# Altium project SAU-G0.PrjPcb
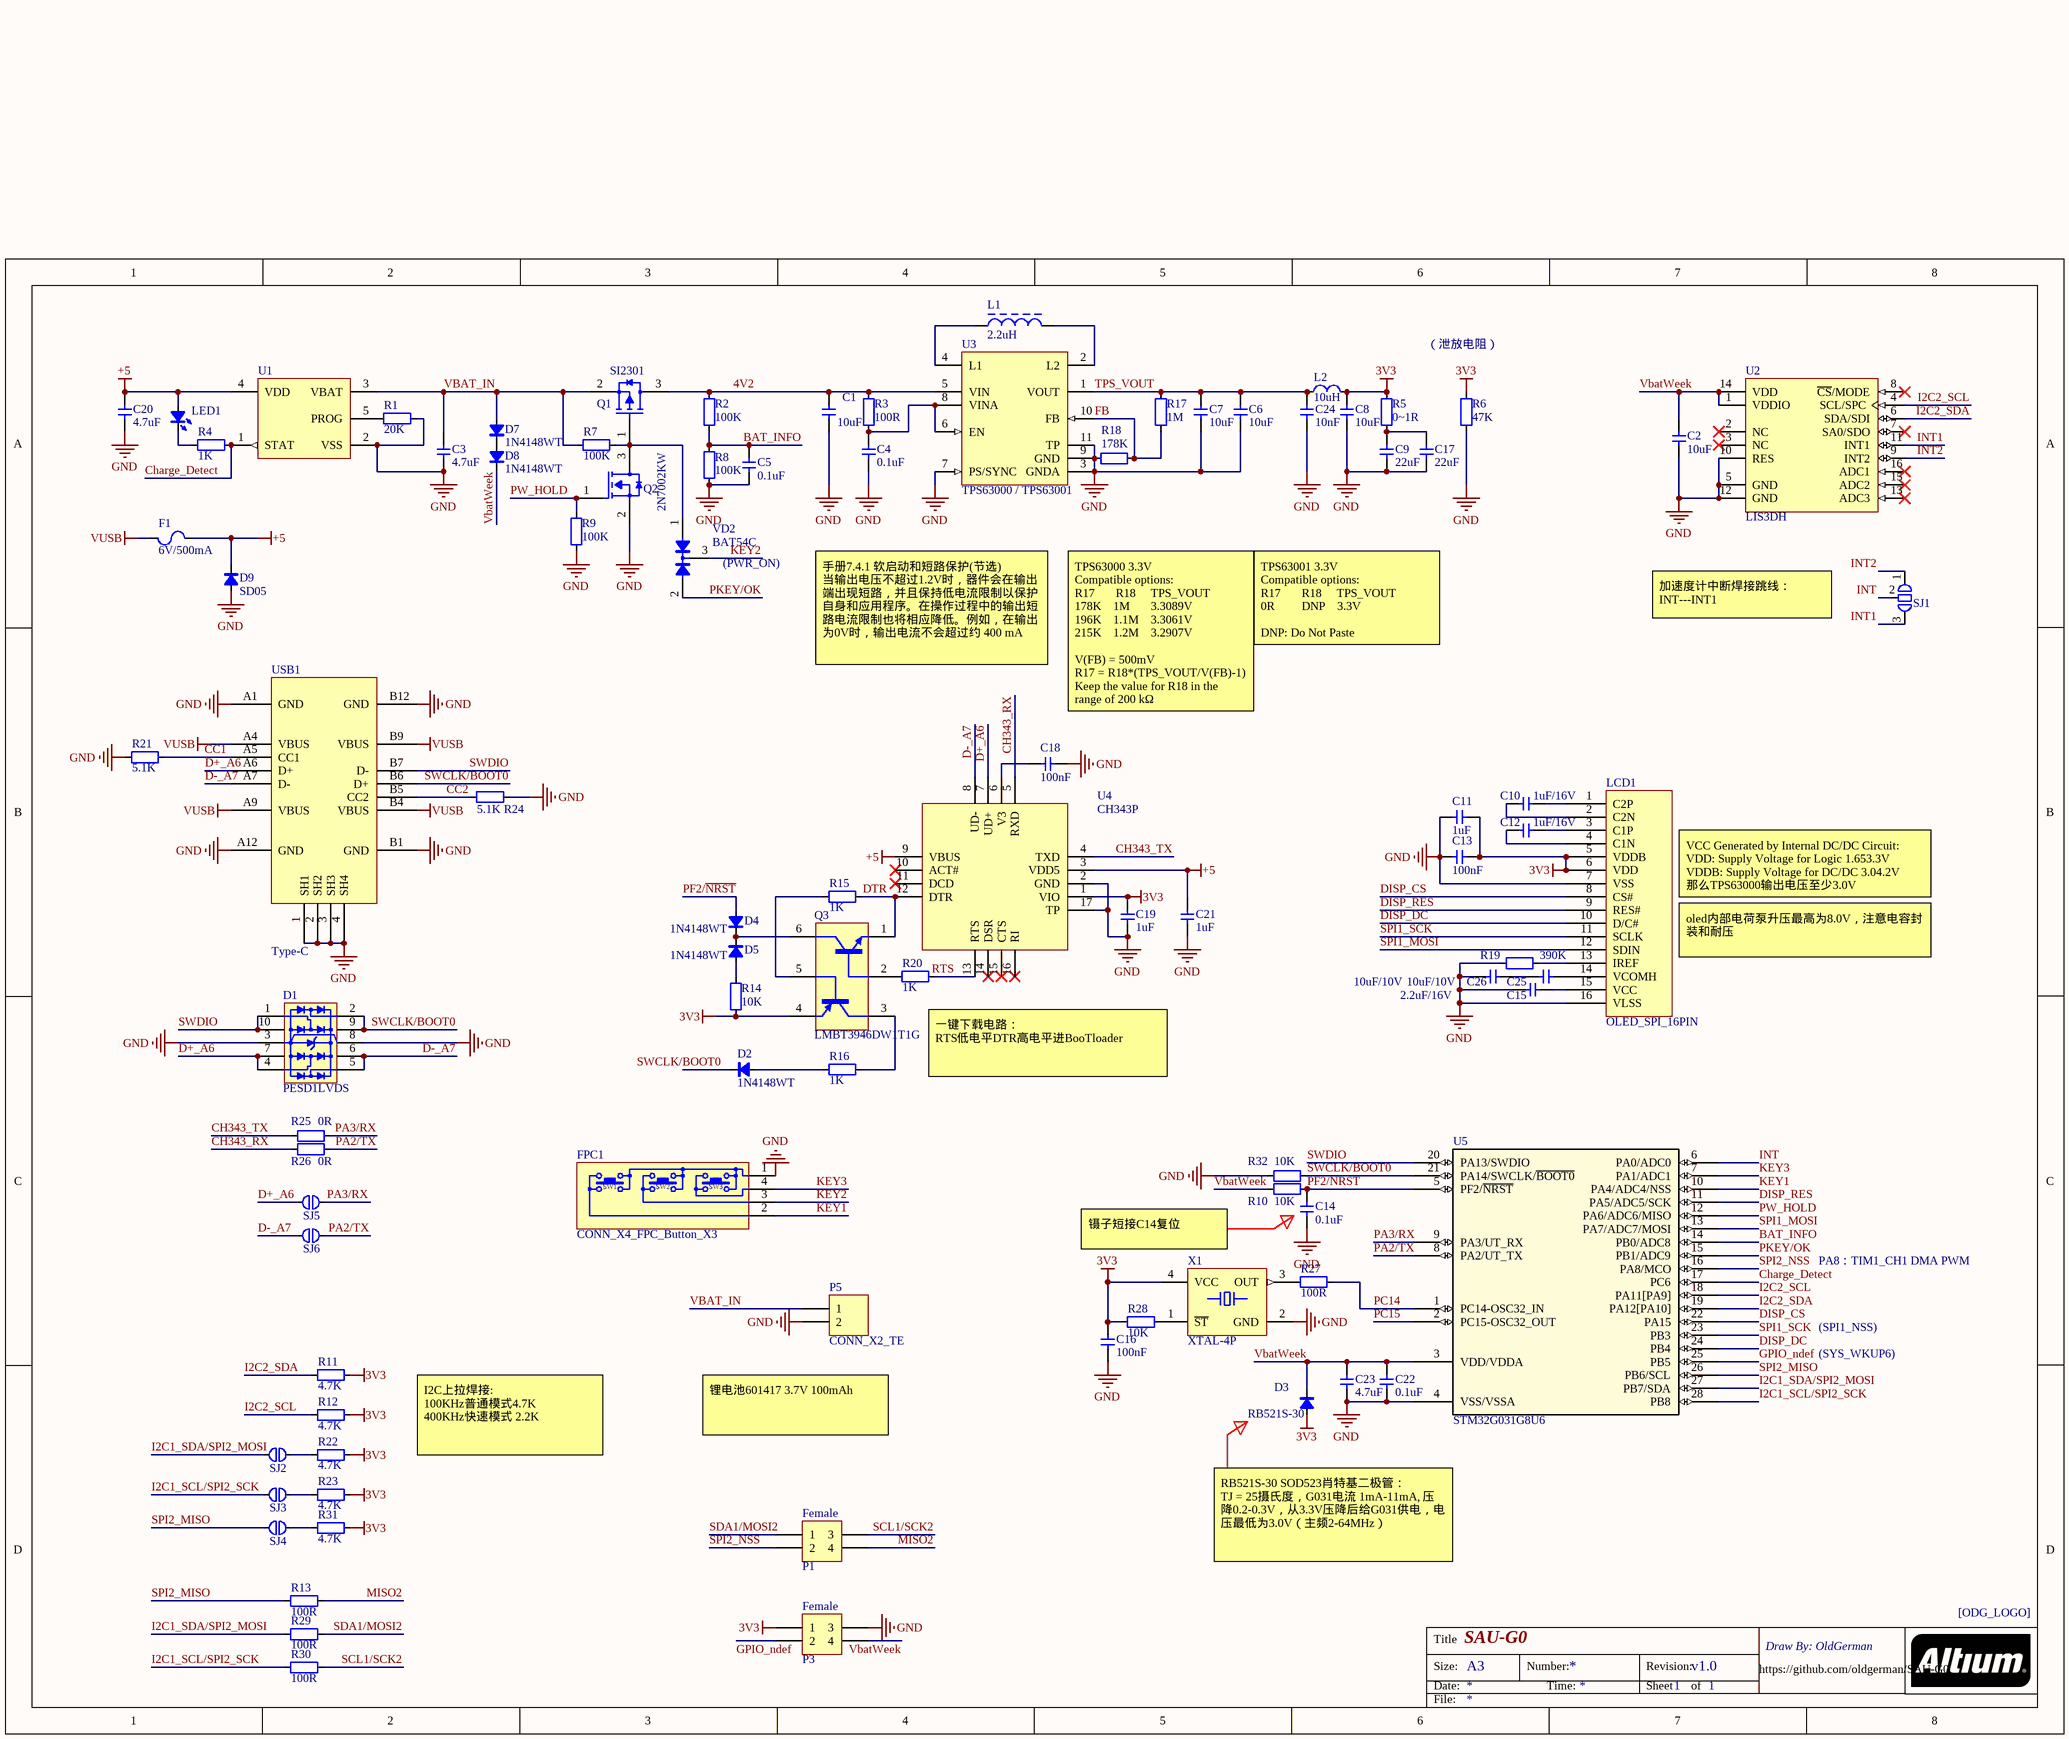
[diagram p0: SAU-G0_sheet1.SchDoc]
1 sheet, 93 parts. Net scope: global (net labels, ports and power ports of the same name join across sheets).
Board file: SAU-G0.PcbDoc

## Sheet SAU-G0_sheet1.SchDoc: SAU-G0
size A3; Address1: Draw By: OldGerman; Revision: v1.0; SheetNumber: 1; SheetTotal: 1

### Parts
C1  10uF  [C0402]
C2  10uF  [C0402]
C3  4.7uF  [C0603]
C4  0.1uF  [C0402]
C5  0.1uF  [C0402]
C6  10uF  [C0402]
C7  10uF  [C0402]
C8  10uF  [C0402]
C9  22uF  [C0603]
C10  1uF/16V  [C0402]
C11  1uF  [C0402]
C12  1uF/16V  [C0402]
C13  100nF  [C0402]
C14  0.1uF  [C0402]
C15  2.2uF/16V  [C0603]
C16  100nF  [C0402]
C17  22uF  [C0603]
C18  100nF  [C0402]
C19  1uF  [C0402]
C20  4.7uF  [C0603]
C21  1uF  [C0402]
C22  0.1uF  [C0402]
C23  4.7uF  [C0402]
C24  10nF  [C0402]
C25  10uF/10V  [C0402]
C26  10uF/10V  [C0402]
D1  PESD1LVDS  [DFN2510-10_SOT1165-1]
D2  1N4148WT  [SOD-523]
D3  RB521S-30  [SOD-523]
D4  1N4148WT  [SOD-523]
D5  1N4148WT  [SOD-523]
D7  1N4148WT  [SOD-523]
D8  1N4148WT  [SOD-523]
D9  SD05  [SOD-323]
F1  6V/500mA  [FUSE0603_0.5MM]
FPC1  CONN_X4_FPC_Button_X3  [FPC_Buttons_X3_Flip_to_PCB_Buttom_to_Back_3.06mm_NO_3D_NO_SLIK_1]
L1  2.2uH  [TAIYO YUDEN MAMK2520T1R0M]
L2  10uH  [FER0603]
LCD1  OLED_SPI_16PIN  [oled_64x48_0.66_SSD1306_TOP_FPC_to_BACK_1mm_NO_3D_NO_SLIK_1]
LED1  LED  [LED0603_WHITE]  (value not drawn)
ODG4  ODG_LOGO  [ODG_LOGO]  (value not drawn)
P1  Female  [2.0mm_Fmale_2x2]
P3  Female  [2.0mm_Fmale_2x2]
P5  CONN_X2_TE  [TE-198181x_Female+Male]
Q1  SI2301  [INFINEON SOT-23-3]
Q2  2N7002KW  [DIODES SOT-323-3]
Q3  LMBT3946DW1T1G  [ON SEMI SOT-363]
R1  20K  [R0402]
R2  100K  [R0402]
R3  100R  [R0402]
R4  1K  [R0402]
R5  0~1R  [R0402]
R6  47K  [R0603]
R7  100K  [R0402]
R8  100K  [R0402]
R9  100K  [R0402]
R10  10K  [R0402]
R11  4.7K  [R0402]
R12  4.7K  [R0402]
R13  100R  [R0402]
R14  10K  [R0402]
R15  1K  [R0402]
R16  1K  [R0402]
R17  1M  [R0402]
R18  178K  [R0402]
R19  390K  [R0402]
R20  1K  [R0402]
R21  5.1K  [R0402]
R22  4.7K  [R0402]
R23  4.7K  [R0402]
R24  5.1K  [R0402]
R25  0R  [R0402]
R26  0R  [R0402]
R27  100R  [R0402]
R28  10K  [R0402]
R29  100R  [R0402]
R30  100R  [R0402]
R31  4.7K  [R0402]
R32  10K  [R0402]
SJ1  SJ_3P  [SJ_3P_MINI]  (value not drawn)
SJ2  SJ_2P  [SJ_2P_TINY]  (value not drawn)
SJ3  SJ_2P  [SJ_2P_TINY]  (value not drawn)
SJ4  SJ_2P  [SJ_2P_TINY]  (value not drawn)
SJ5  SJ_2P  [SJ_2P_TINY]  (value not drawn)
SJ6  SJ_2P  [SJ_2P_TINY]  (value not drawn)
U1  MCP73831T  [MICROCHIP SOT-23-5 OT]  (value not drawn)
U2  LIS3DH  [LGA-16-3X3]
U3  TPS63000 / TPS63001  [TI PVSON-10 3x3MM DRC]
U4  CH343P  [CH343P_QFN-16 3x3MM]
U5  STM32G031G8U6  [UFQFPN28-4x4mm_ODG]
USB1  Type-C  [TYPE-C_14P_Vertical_H_10mm]
VD2  BAT54C  [DIODES SOT-323-3]
X1  XTAL-4P  [NDK NX2520SA]

### Nets
3V3: C8.1 C11.1 C13.2 C16.1 C19.2 D3.1(A) L2.2 LCD1.5(VDDB) LCD1.6(VDD) P3.1 Q3.4(E) R5.2 R6.2 R11.1 R12.1 R14.1 R22.1 R23.1 R28.2 R31.1 U4.1(VIO) X1.4(VCC)
+5: C20.1 C21.2 D9.2(C) F1.2 LED1.1(A) U1.4(VDD) U4.3(VDD5) U4.9(VBUS)
GND: C1.2 C2.2 C3.2 C4.2 C5.2 C6.2 C7.2 C8.2 C9.2 C11.2 C13.1 C14.2 C15.2 C16.2 C17.2 C18.2 C19.1 C20.2 C21.1 C22.2 C23.2 C24.2 C26.2 D1.3(GND) D1.8(GND) D9.1(A) FPC1.1 LCD1.7(VSS) LCD1.16(VLSS) P3.3 P5.2 Q2.2(S) R1.1 R6.1 R8.1 R9.1 R18.2 R19.1 R21.2 R24.1 R32.1 U1.2(VSS) U2.5(GND) U2.10(RES) U2.12(GND) U3.3(GNDA) U3.7(PS/SYNC) U3.9(GND) U3.11(TP) U4.2(GND) U4.17(TP) U5.4(VSS/VSSA) USB1.1(SH1) USB1.2(SH2) USB1.3(SH3) USB1.4(SH4) USB1.A1(GND) USB1.A12(GND) USB1.B1(GND) USB1.B12(GND) X1.2(GND)
VUSB: F1.1 USB1.A4(VBUS) USB1.A9(VBUS) USB1.B4(VBUS) USB1.B9(VBUS)
4V2: C1.1 Q1.3(D) R2.2 R3.2 U3.5(VIN)
BAT_INFO: C5.1 R2.1 R8.2 U5.14(PB0/ADC8)
CC1: R21.1 USB1.A5(CC1)
CC2: R24.2 USB1.B5(CC2)
CH343_RX: R26.1 U4.5(RXD)
CH343_TX: R25.1 U4.4(TXD)
Charge_Detect: R4.1 U1.1(STAT) U5.17(PC6)
D+_A6: D1.4(I/O) D1.7(GND) SJ5.1 U4.7(UD+) USB1.A6(D+)
D-_A7: D1.5(I/O) D1.6(GND) SJ6.1 U4.8(UD-) USB1.A7(D-)
DISP_CS: LCD1.8(CS#) U5.22(PA15)
DISP_DC: LCD1.10(D/C#) U5.24(PB4)
DISP_RES: LCD1.9(RES#) U5.11(PA5/ADC5/SCK)
DTR: Q3.1(E) R15.2 U4.12(DTR)
FB: R17.1 R18.1 U3.10(FB)
GPIO_ndef: P3.2 U5.25(PB5)
I2C1_SCL/SPI2_SCK: R30.2 SJ3.1 U5.28(PB8)
I2C1_SDA/SPI2_MOSI: R29.2 SJ2.1 U5.27(PB7/SDA)
I2C2_SCL: R12.2 U2.4(SCL/SPC) U5.18(PA11[PA9])
I2C2_SDA: R11.2 U2.6(SDA/SDI) U5.19(PA12[PA10])
INT: SJ1.2 U5.6(PA0/ADC0)
INT1: SJ1.3 U2.11(INT1)
INT2: SJ1.1 U2.9(INT2)
KEY1: FPC1.2 U5.10(PA4/ADC4/NSS)
KEY2: FPC1.3 VD2.3
KEY3: FPC1.4 U5.7(PA1/ADC1)
MISO2: P1.4 R13.1
PA2/TX: R26.2 SJ6.2 U5.8(PA2/UT_TX)
PA3/RX: R25.2 SJ5.2 U5.9(PA3/UT_RX)
PC14: R27.1 U5.1(PC14-OSC32_IN)
PC15: U5.2(PC15-OSC32_OUT)
PF2/~{NRST}: C14.1 D4.1(A) R10.1 U5.5(PF2/~{NRST})
PKEY/OK: U5.15(PB1/ADC9) VD2.2
PW_HOLD: Q2.1(G) R9.2 U5.12(PA6/ADC6/MISO)
RTS: R20.1 U4.13(RTS)
SCL1/SCK2: P1.3 R30.1
SDA1/MOSI2: P1.1 R29.1
SPI1_MOSI: LCD1.12(SDIN) U5.13(PA7/ADC7/MOSI)
SPI1_SCK: LCD1.11(SCLK) U5.23(PB3)
SPI2_MISO: R13.2 SJ4.1 U5.26(PB6/SCL)
SPI2_NSS: P1.2 U5.16(PA8/MCO)
SWCLK/BOOT0: D1.2(I/O) D1.9(GND) D2.2(C) R32.2 U5.21(PA14/SWCLK/~{BOOT0}) USB1.B6(D+)
SWDIO: D1.1(I/O) D1.10(GND) U5.20(PA13/SWDIO) USB1.B7(D-)
TPS_VOUT: C6.1 C7.1 C24.1 L2.1 R17.2 U3.1(VOUT)
VBAT_IN: C3.1 D7.1(A) P5.1 Q1.2(S) R7.2 U1.3(VBAT)
VbatWeek: C2.1 C22.1 C23.1 D3.2(C) D8.2(C) P3.4 R10.2 U2.1(VDDIO) U2.14(VDD) U5.3(VDD/VDDA)
NetC4_1: C4.1 R3.1 U3.6(EN) U3.8(VINA)
NetC9_1: C9.1 C17.1 R5.1
NetC10_1: C10.1 LCD1.1(C2P)
NetC10_2: C10.2 LCD1.2(C2N)
NetC12_1: C12.1 LCD1.3(C1P)
NetC12_2: C12.2 LCD1.4(C1N)
NetC15_1: C15.1 LCD1.15(VCC)
NetC18_1: C18.1 U4.6(V3)
NetC25_1: C25.1 LCD1.14(VCOMH)
NetC25_2: C25.2 C26.1
NetD2_1: D2.1(A) R16.1
NetD4_2: D4.2(C) D5.2(C) Q3.6(C)
NetD5_1: D5.1(A) R14.2
NetD7_2: D7.2(C) D8.1(A)
NetL1_1: L1.1 U3.4(L1)
NetL1_2: L1.2 U3.2(L2)
NetLCD1_13: LCD1.13(IREF) R19.2
NetLED1_2: LED1.2(K) R4.2
NetQ1_1: Q1.1(G) Q2.3(D) R7.1 VD2.1
NetQ3_2: Q3.2(B) R20.2
NetQ3_3: Q3.3(C) R16.2
NetQ3_5: Q3.5(B) R15.1
NetR1_2: R1.2 U1.5(PROG)
NetR22_2: R22.2 SJ2.2
NetR23_2: R23.2 SJ3.2
NetR27_2: R27.2 X1.3(OUT)
NetR28_1: R28.1 X1.1(~{ST})
NetR31_2: R31.2 SJ4.2

Not connected (* = marked no-connect by the designer): U2 2(NC)* 3(NC)* 7(SA0/SDO)* 8(~{CS}/MODE)* 13(ADC3)* 15(ADC2)* 16(ADC1)*; U4 10(ACT#)* 11(DCD)* 14(DSR)* 15(CTS)* 16(RI)*

### Notes on the sheet
- （泄放电阻）
- (near VD2) (PWR_ON)
- 加速度计中断焊接跳线：
  INT---INT1
- 手册7.4.1 软启动和短路保护(节选)
  当输出电压不超过1.2V时，器件会在输出端出现短路，并且保持低电流限制以保护自身和应用程序。在操作过程中的输出短路电流限制也将相应降低。例如，在输出为0V时，输出电流不会超过约 400 mA
- TPS63001 3.3V
  Compatible options:
  R17       R18     TPS_VOUT
  0R         DNP    3.3V
  DNP: Do Not Paste
- TPS63000 3.3V
  Compatible options:
  R17       R18     TPS_VOUT
  178K    1M       3.3089V
  196K    1.1M    3.3061V
  215K    1.2M    3.2907V
  V(FB) = 500mV
  R17 = R18*(TPS_VOUT/V(FB)-1)
  Keep the value for R18 in the range of 200 kΩ
- VCC Generated by Internal DC/DC Circuit:
  VDD: Supply Voltage for Logic 1.653.3V
  VDDB: Supply Voltage for DC/DC 3.04.2V
  那么TPS63000输出电压至少3.0V
- oled内部电荷泵升压最高为8.0V，注意电容封装和耐压
- (near R20) 一键下载电路：
  RTS低电平DTR高电平进BooTloader
- 镊子短接C14复位
- PA8：TIM1_CH1 DMA PWM
- (SYS_WKUP6)
- (SPI1_NSS)
- I2C上拉焊接:
  100KHz普通模式4.7K
  400KHz快速模式 2.2K
- 锂电池601417 3.7V 100mAh
- RB521S-30 SOD523肖特基二极管：
  TJ = 25摄氏度，G031电流 1mA-11mA, 压降0.2-0.3V，从3.3V压降后给G031供电，电压最低为3.0V（主频2-64MHz）
- https://github.com/oldgerman/SAU-G0
- Title
- Size:
- Date:
- A3
- Number:
- Time:
- Revision:
- Sheet
- of
- File:
- (in symbol CONN_X4_FPC_Button_X3) SW1; SW2; SW3
- (in symbol ODG_LOGO) [ODG_LOGO]

### Library data of the parts
C1-C26 = CAP: Capacitor; Value: 0.1u
D1 = PESD1LVDS: Ultra-Low Capacitance TVS Protection; BOM名称: 钳位IC; 版权归属: 源创客; 属性: 30V/0.2A; 学习资源: www.ooocke.com
D2-D5 D7 D8 = DIODE: 二极管
D9 = DIODE: 单向 5V TVS
F1 = FUSE: 贴片自恢复保险丝
FPC1 = CONN_X4_FPC_Button_X3: 豆老板1.6元车G031电子烟拆机的玩意儿
L1 = Inductor
L2 = inductor_mini: 贴片叠层电感
LED1 = LED: Value: color?
P1 P3 = CONN_2X2
P5 = CONN_X2_TE: 泰科1981812-1 / 泰科1981813-1 / 使用32AWG 特氟龙线外径0.38mm / 刺破式 /
Q1 = P-MOS_123: P-MOS
Q2 = N-MOS_123: N-MOS
Q3 = LMBT3946DW1T1G: PNP+NPN, SOT-363; ComponentLink1Description: Datasheet; ComponentLink1URL: https://fscdn.rohm.com/en/products/databook/datasheet/discrete/transistor/digital/umh3ntn-e.pdf
R1-R32 = RES: Resistor; Value: 22R
SJ1 = SJ_3P: 焊接跳线二选一
SJ2-SJ6 = SJ_2P: 焊接跳线
U2 = LIS3DH: The LIS3DH is an ultra-low-power highperformance three-axis linear accelerometer belonging to the “nano” family, with digital I2C/SPI serial interface standard output. The device features ultra-low-power operational modes that allow advanced power saving and smart embedded functions.; ComponentLink1Description: Datasheet; ComponentLink1URL: https://www.bosch-sensortec.com/media/boschsensortec/downloads/datasheets/bst-bmi160-ds000.pdf
U3 = TPS63000: Buck-Boost Converter / 具有 1.8A 电流开关并采用 3x3 QFN 封装的高效率降压/升压转换器; ComponentLink1Description: TPS63000; ComponentLink1URL: https://www.ti.com.cn/cn/lit/gpn/tps63000
U4 = CH343P: usb to ttl
U5 = STM32G031G8U6: No Description Available; Mfr_Name: STMicroelectronics; Copyright: Copyright (C) 2022 Ultra Librarian. All rights reserved.; Manufacturer_Part_Number: STM32G031G8U6; RefDes: RefDes; Type: DEV
USB1 = USB-Type-C_14P
VD2 = BAT54C: 贴片肖特基二极管; BOM名称: 肖特基二极管; 版权归属: 源创客; 属性: 30V/0.2A; 学习资源: www.ooocke.com
X1 = XTAL-4P_oscillator: 4脚有源晶振; BOM名称: 4脚无源晶振; 版权归属: 源创客; 学习资源: www.ooocke.com